# EasyEDA Pro project PicoUSBMotherboardV3.3.eprj, board PCB1
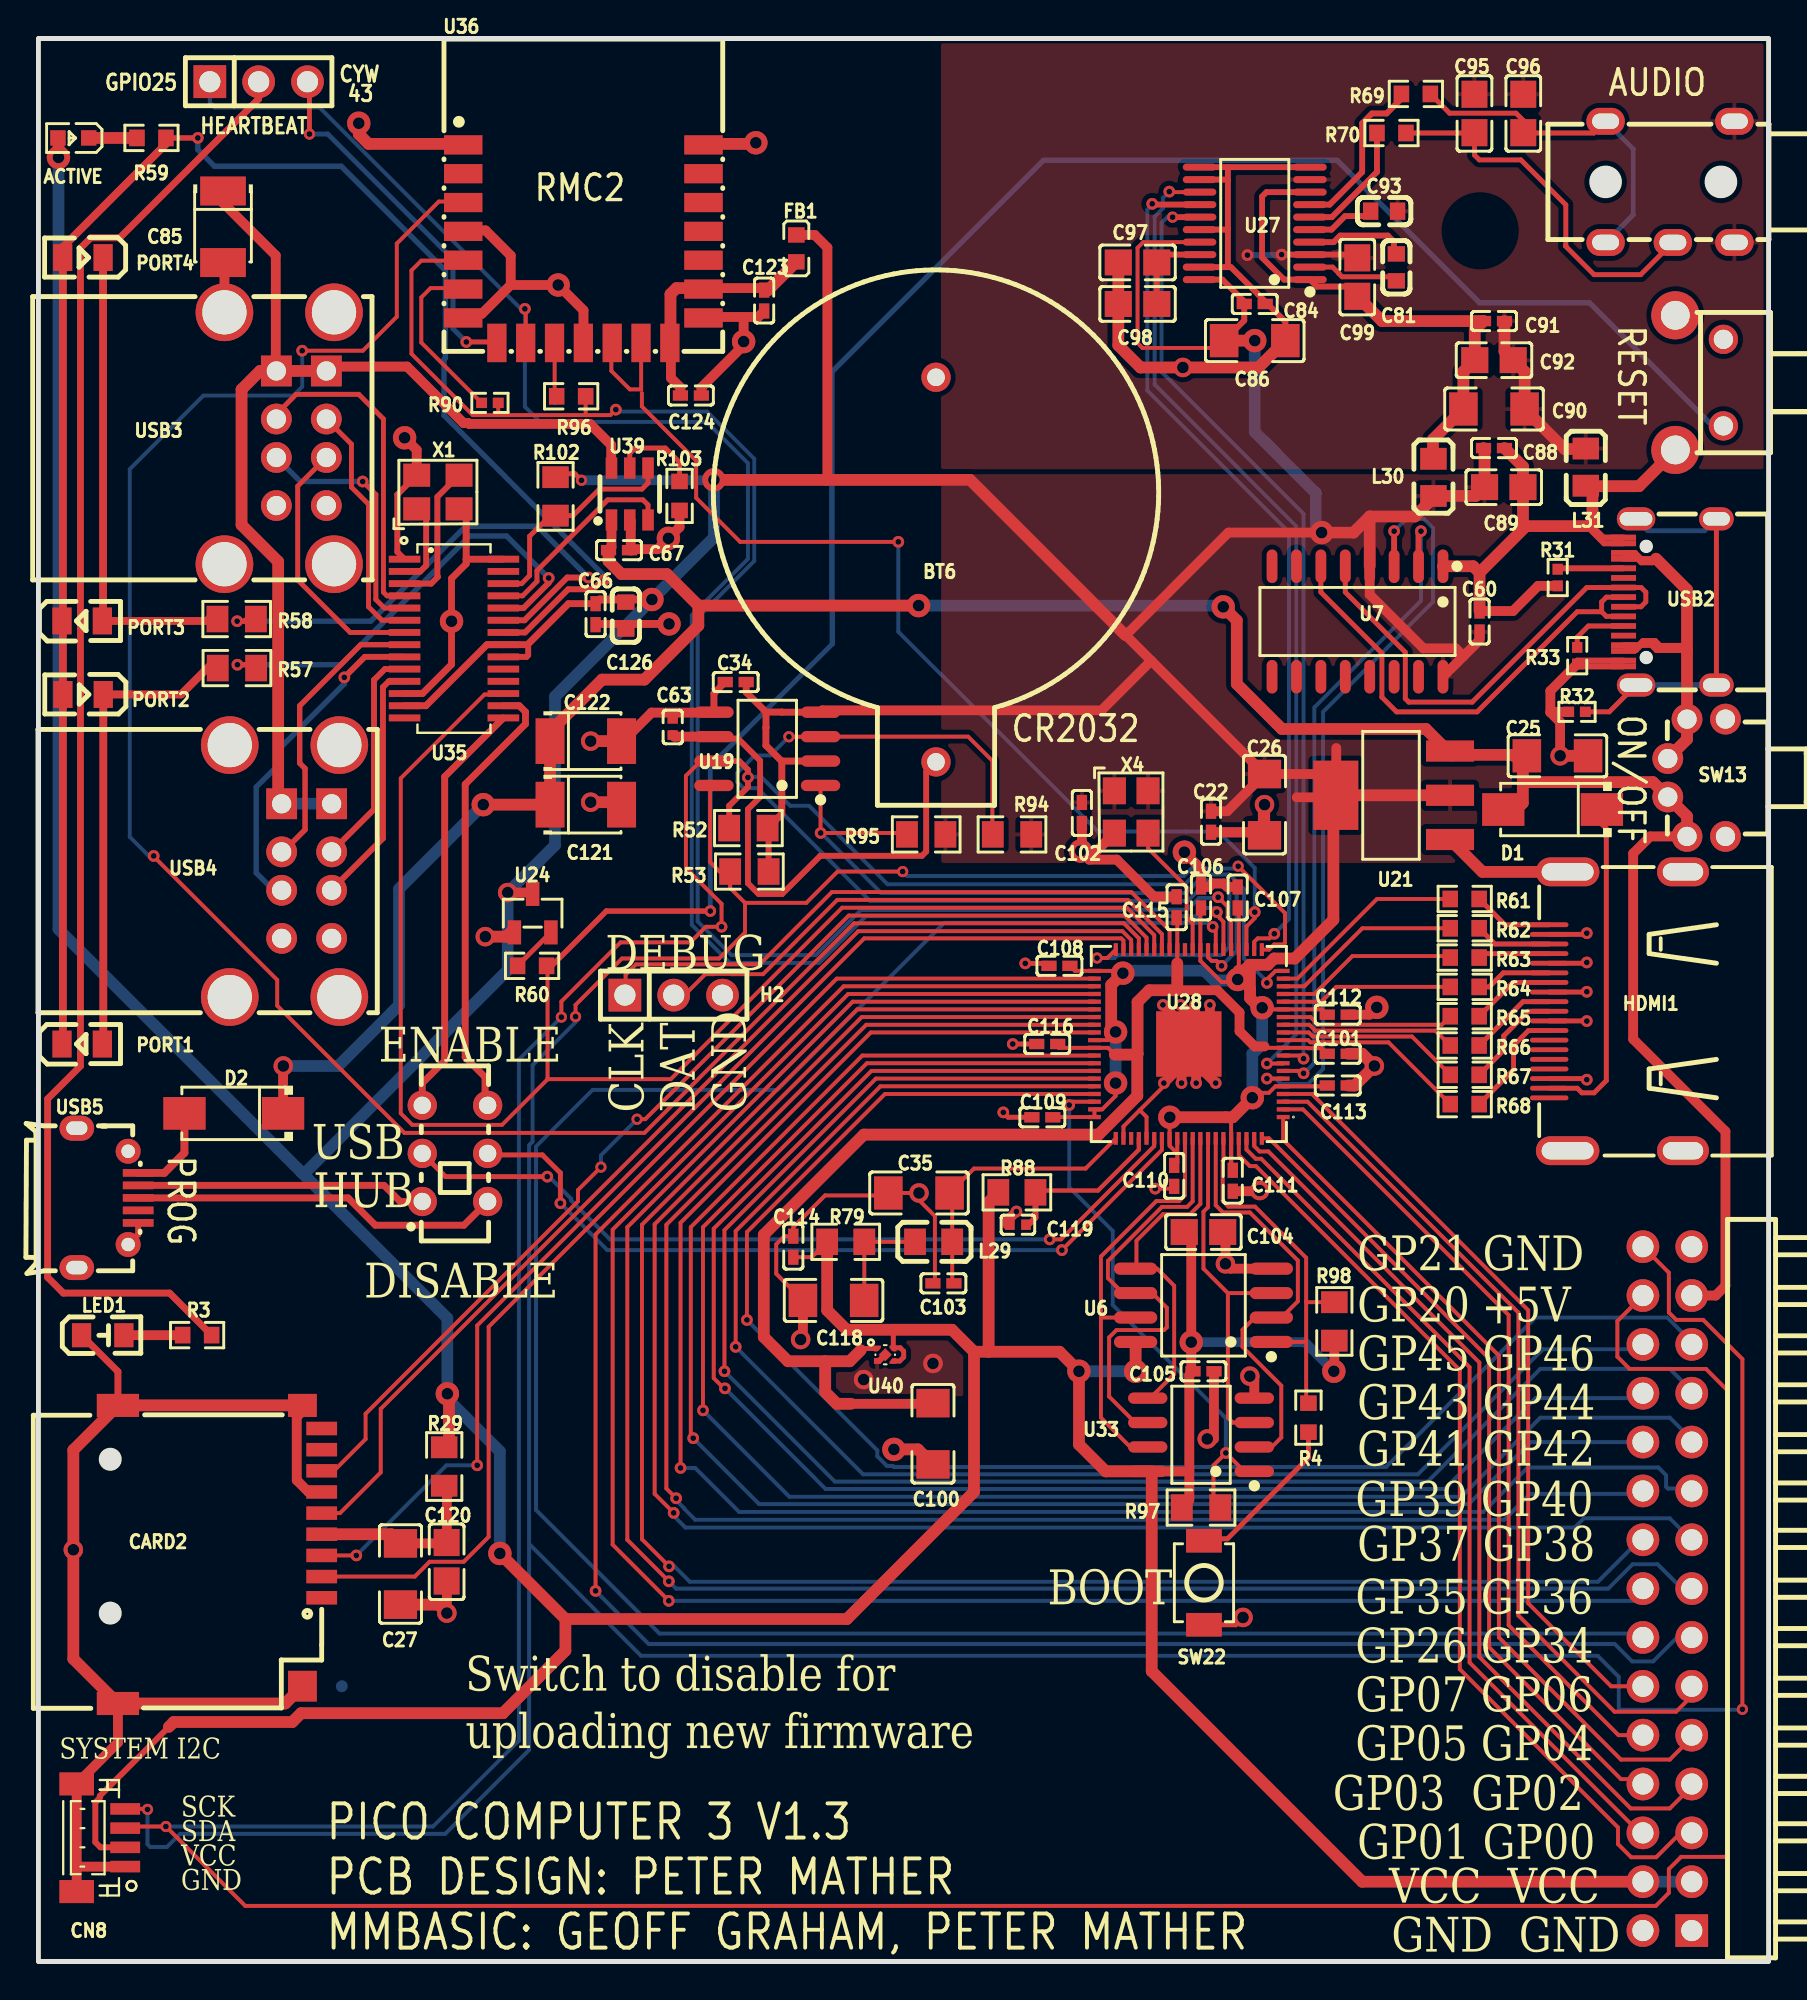
[diagram p1: board, top side]
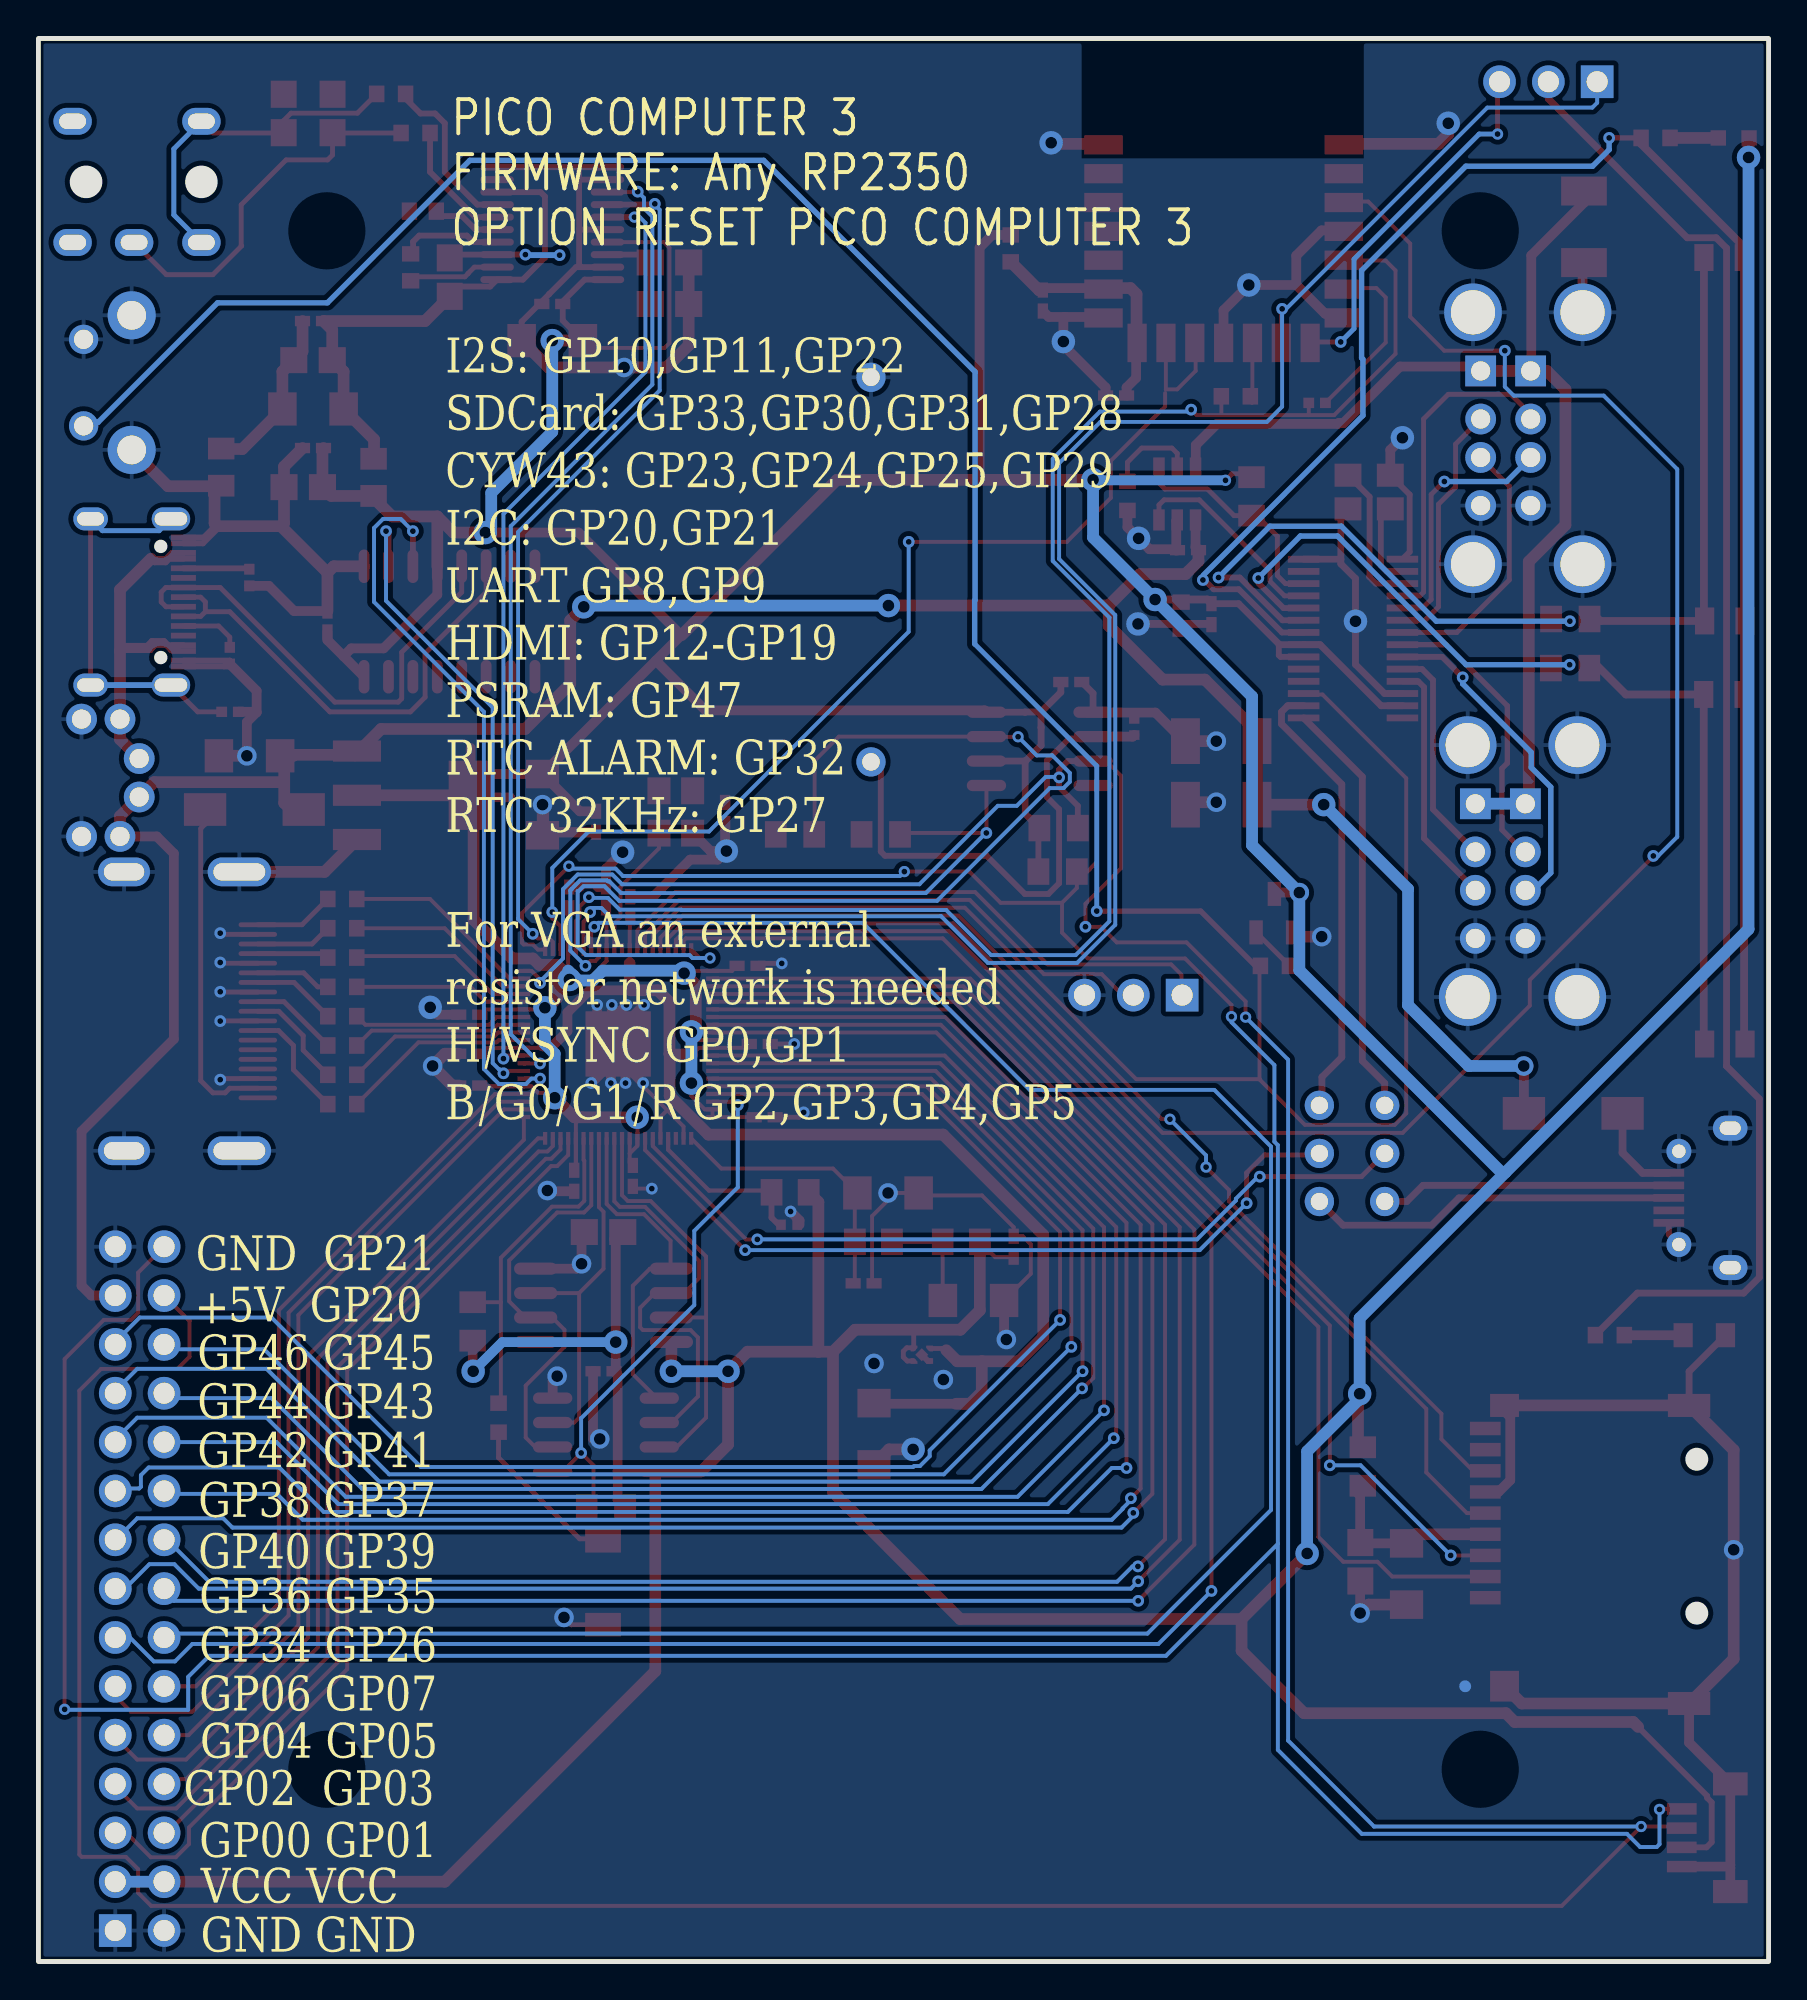
[diagram p2: board, bottom side, seen from below]

Outline 90 x 100 mm; copper layers: Top Layer, Bottom Layer. Coordinates in mm from the lower left corner of the outline.
Outline path: rectangle 0,100 90,0
Stack: Top Layer 0.035mm / Dielectric1 1.51mm FR4 er 4.5 / Bottom Layer 0.035mm

## Design rules (mm)
template: JLCPCB Capability(Two Layers Board)
spacing copperThickness1oz (default): track to track 0.102, other pairs 0.152 to 0.3
spacing copperThickness2oz: track to track 0.203, other pairs 0.152 to 0.3
track width copperThickness1oz (default): min 0.127, default 0.254, max 2.54
track width copperThickness2oz: min 0.203, default 0.254, max 2.54
differential pair differentialPair (default): width min 0.127, default 0.254, max 2.54; gap min 0.152, default 0.152
via viaSize (default): diameter min 0.5, default 0.61, max 10; hole min 0.3, default 0.305, max 6.3

## Placement (name value [footprint] x y rotation side)
ACTIVE  KT-0603R  [LED0603-RD]  1.81 94.83 180 top
BT6  BS-04-A1BJ005  [BAT-TH_BS-04-A1BJ004]  46.69 72.38 270 top
C22  100nF  [C0402_NEW]  61 59.27 90 top
C25  10uF  [C1206]  79.02 62.7 180 top
C26  10uF  [C1206]  63.78 60.16 90 top
C27  10uF  [C1206]  18.83 20.15 90 top
C34  100nF  [C0402_NEW]  36.27 66.53 180 top
C35  10uF  [C1206]  45.81 39.97 0 top
C60  100nF  [C0402_NEW]  74.97 69.68 270 top
C63  100nF  [C0402]  32.99 64.2 90 top
C66  100nF  [C0402_NEW]  28.98 70.06 90 top
C67  100nF  [C0402_NEW]  30.2 73.39 180 top
C81  2.2uF  [C0603]  70.64 88.1 90 top
C84  100nF  [C0402_NEW]  63.27 86.19 0 top
C85  100uF  [CASE-B_3528]  9.6 90.21 270 top
C86  10uF  [C1206]  63.27 84.29 180 top
C88  100nF  [C0402_NEW]  75.72 78.7 180 top
C89  1nF  [C0805]  76.23 76.67 180 top
C90  22uF  [C1206]  75.72 80.73 180 top
C91  100nF  [C0402_NEW]  75.72 85.3 180 top
C92  10nF  [C0805]  75.72 83.27 180 top
C93  2.2uF  [C0603]  70 91.02 0 top
C95  2.2nF  [C0805]  74.7 96.1 270 top
C96  2.2nF  [C0805]  77.24 96.1 270 top
C97  10uF  [C0805]  57.18 88.35 180 top
C98  100nF  [C0805]  57.18 86.19 180 top
C99  100nF  [C0805]  68.61 87.59 270 top
C100  10uF  [C1206]  46.53 27.44 90 top
C101  100nF  [C0402_NEW]  67.59 47.2 180 top
C102  100nF  [C0402_NEW]  54.28 59.73 90 top
C103  100nF  [C0402_NEW]  47.07 35.27 0 top
C104  100nF  [C0805]  60.6 37.93 180 top
C105  100nF  [C0402_NEW]  60.6 30.69 180 top
C106  100nF  [C0402_NEW]  60.48 55.33 270 top
C107  100nF  [C0402_NEW]  62.38 55.33 270 top
C108  100nF  [C0402_NEW]  53.11 51.78 0 top
C109  100nF  [C0402_NEW]  52.22 43.9 0 top
C110  100nF  [C0402_NEW]  59.08 40.85 90 top
C111  100nF  [C0402_NEW]  62.13 40.6 90 top
C112  100nF  [C0402_NEW]  67.59 49.24 180 top
C113  100nF  [C0402_NEW]  67.59 45.55 180 top
C114  100nF  [C0402_NEW]  39.27 37.17 270 top
C115  100nF  [C0402_NEW]  59.21 54.82 270 top
C116  100nF  [C0402_NEW]  52.48 47.71 0 top
C118  10uF  [C1206]  41.36 34.38 0 top
C119  2.2uF  [C0402]  50.95 38.31 180 top
C120  100nF  [C0805]  21.23 20.79 90 top
C121  100uF  [CASE-B_3528]  28.47 60.16 0 top
C122  100uF  [CASE-B_3528]  28.47 63.46 0 top
C123  100nF  [C0402_NEW]  37.75 86.37 270 top
C124  100nF  [C0402_NEW]  33.94 81.43 180 top
C126  10uF  [C0603]  30.56 69.99 90 top
CARD2  TF PUSH  [TF-SMD_TF-PUSH]  9.43 21.17 270 top
CN5  PJ-313 5JCJ  [AUDIO-TH_PJ-313_5JCJ]  84.87 92.54 180 top
CN8  BM04B-SRSS-TB(LF)(SN)  [CONN-SMD_BM04B-SRSS-TB]  3.25 6.44 90 top
D1  SS14  [SMA_L4.2-W2.6-LS5.3-RD]  78.77 59.9 180 top
D2  SS14  [SMA_L4.2-W2.6-LS5.3-RD]  10.16 44.11 180 top
FB1  BLM18EG471SN1D  [L0603]  39.42 89.08 90 top
H2  DEBUG  [HDR-TH_3P-P2.54-V-M]  33.05 50.25 0 top
H4  PZ254-2-15-W-8.5  [HDR-TH_30P-P2.54-H-M-R2-C15-S2.54-N]  84.73 19.39 90 top
H5  HEART  [HDR-TH_3P-P2.54-V-M]  11.46 97.75 0 top
HDMI1  HDMI-01  [USB-SMD_HDMI-01]  82.07 49.41 90 top
L29  10uH  [L0805]  46.57 37.43 180 top
L30  10uH  [L0805]  72.57 77.18 270 top
L31  10uH  [L0805]  80.49 77.71 90 top
LED1  NCD0805R1  [LED0805-RD]  3.34 32.57 0 top
PORT1  KT-0805G  [LED0805-R-RD]  2.28 47.71 0 top
PORT2  KT-0805G  [LED0805-R-RD]  2.32 65.89 180 top
PORT3  KT-0805G  [LED0805-R-RD]  2.28 69.71 0 top
PORT4  KT-0805G  [LED0805-R-RD]  2.31 88.61 180 top
R3  1kΩ  [R0603]  8.25 32.57 180 top
R4  1kΩ  [R0603]  66.07 28.28 270 top
R29  2.2Ω  [R0805]  21.11 25.74 90 top
R31  5.1kΩ  [R0402]  79.03 71.97 90 top
R32  5.1kΩ  [R0402]  80.05 67.9 90 top
R33  1MΩ  [R0402]  80.04 64.98 0 top
R52  10kΩ  [R0805]  36.93 58.94 0 top
R53  10kΩ  [R0805]  36.98 56.68 0 top
R57  220Ω  [R0805]  10.33 67.26 180 top
R58  220Ω  [R0805]  10.31 69.81 180 top
R59  470Ω  [R0603]  5.88 94.83 180 top
R60  220Ω  [R0603]  25.68 51.78 180 top
R61  220Ω  [R0603]  74.19 55.25 0 top
R62  220Ω  [R0603]  74.19 53.73 0 top
R63  220Ω  [R0603]  74.19 52.21 0 top
R64  220Ω  [R0603]  74.19 50.68 0 top
R65  220Ω  [R0603]  74.19 49.16 0 top
R66  220Ω  [R0603]  74.19 47.63 0 top
R67  220Ω  [R0603]  74.19 46.11 0 top
R68  220Ω  [R0603]  74.19 44.59 0 top
R69  470Ω  [R0603]  71.65 97.12 180 top
R70  470Ω  [R0603]  70.38 95.08 180 top
R79  10Ω  [R0805_NEW]  42 37.43 180 top
R88  10Ω  [R0805_NEW]  50.9 40 0 top
R90  470Ω  [R0402]  23.49 81.05 180 top
R94  10kΩ  [R0805]  50.64 58.61 0 top
R95  10kΩ  [R0805]  46.18 58.61 0 top
R96  10kΩ  [R0603]  27.71 81.39 180 top
R97  10kΩ  [R0805]  60.48 23.61 180 top
R98  10kΩ  [R0805]  67.41 33.29 270 top
R102  10kΩ  [R0805]  26.9 76.19 90 top
R103  20kΩ  [R0603]  33.35 76.21 90 top
SW13  XKB5858-Z-E  [SW-TH_XKB5858-Z-E]  86.26 61.56 270 top
SW15  TC-6615-7.5-260G  [SW-TH_4P-L7.5-W7.5-P4.50]  86.4 82.1 270 top
SW21  MSS22D18G2  [SW-TH_MSS22D18GX]  21.67 42.02 90 top
SW22  TS-1088-AR02016  [SW-SMD_L3.9-W3.0-P4.45]  60.63 19.7 270 top
U6  W25Q128JVSIQ  [SOIC-8_L5.3-W5.3-P1.27-LS8.0-BL]  60.6 34.12 90 top
U7  CH340C  [SOP-16_L10.0-W3.9-P1.27-LS6.0-BL]  68.62 69.68 180 top
U19  DS3231MZ+TRL  [SOIC-8_L4.9-W3.9-P1.27-LS6.0-BL]  37.91 63.06 90 top
U21  AMS1117-3.3  [SOT-223-3_L6.5-W3.4-P2.30-LS7.0-BR]  70.46 60.65 0 top
U24  MAX809R  [SOT-23-3_L2.9-W1.3-P1.90-LS2.4-BR]  25.71 54.52 270 top
U27  PCM5102APWR  [TSSOP-20_L6.5-W4.4-P0.65-LS6.4-BL]  63.27 90.38 90 top
U28  RP2350B  [QFN-80_L10.0-W10.0-P0.40-TL-EP3.4]  59.84 47.71 180 top
U33  APS6404L-3SQR-SN  [SOIC-8_L4.9-W3.9-P1.27-LS6.0-BL]  60.48 27.39 90 top
U35  CH334U  [QSOP-28_L9.9-W3.9-P0.64-LS6.0-BL]  21.62 68.79 270 top
U36  RMC20452T  [WIRELM-SMD_RMC20452T]  28.35 89.32 0 top
U39  TPS2552DBVR  [SOT-23-6_L2.9-W1.6-P0.95-LS2.8-BR]  30.76 76.31 270 top
U40  LW31135N11E  [UDFN-4_L1.0-W1.0-P0.65-TL]  44.05 31.55 0 top
USB2  KH-TYPE-C-16P  [USB-C-SMD_KH-TYPE-C-16P]  84.87 70.7 90 top
USB3  AF SS-JB17.6  [USB-A-TH_AF-SS-JB17.6]  12.53 79.21 270 top
USB4  AF SS-JB17.6  [USB-A-TH_AF-SS-JB17.6]  12.8 56.7 270 top
USB5  MicroXNJ  [MICRO-USB-SMD_MICROXNJ]  3.59 39.71 270 top
X1  12MHz  [OSC-SMD_4P-L3.2-W2.5-BL]  20.78 76.41 0 top
X4  12MHz  [OSC-SMD_4P-L3.2-W2.5-BL]  56.85 59.78 270 top

## Footprints (pads in the part's own frame, mm; a bottom-side part is the same pattern mirrored in y, then rotated)
AUDIO-TH_PJ-313_5JCJ
  oval 2x1.4 hole 1.4x0.8: 1(-3.35,3.15) 1(-3.35,-3.15) 2(3.35,3.15) 2(3.35,-3.15) 3(-0.15,3.15)
BAT-TH_BS-04-A1BJ004
  round 1.524 hole 0.914: 1(10,0) 2(-10,0)
C0402
  rect 0.5x0.54 smd: 1(-0.42,0) 2(0.42,0)
C0402_NEW
  rect 0.79x0.54 smd: 1(-0.545,0) 2(0.545,0)
C0603
  rect 0.8x0.9 smd: 1(-0.7,0) 2(0.7,0)
C0805
  rect 1.41x1.35 smd: 1(-1,0) 2(1,0)
C1206
  rect 1.485x1.728 smd: 1(-1.593,0) 2(1.593,0)
CASE-B_3528
  rect 1.506x2.376 smd: 1(-1.861,0) 2(1.861,0)
CONN-SMD_BM04B-SRSS-TB
  rect 1.2x1.8 smd: 0(-2.8,1.262) 0(2.8,1.262)
  rect 0.6x1.55 smd: 1(-1.5,-1.262) 2(-0.5,-1.262) 3(0.5,-1.262) 4(1.5,-1.262)
HDR-TH_3P-P2.54-V-M
  rect 1.7x1.7 hole 1.1: 1(-2.54,0)
  round 1.7 hole 1.1: 2(0,0) 3(2.54,0)
HDR-TH_30P-P2.54-H-M-R2-C15-S2.54-N
  rect 1.7x1.7 hole 1.1: 1(-17.78,-1.27)
  round 1.7 hole 1.1: 2(-17.78,1.27) 3(-15.24,-1.27) 4(-15.24,1.27) 5(-12.7,-1.27) 6(-12.7,1.27) 7(-10.16,-1.27) 8(-10.16,1.27) 9(-7.62,-1.27) 10(-7.62,1.27) 11(-5.08,-1.27) 12(-5.08,1.27) 13(-2.54,-1.27) 14(-2.54,1.27) 15(0,-1.27) 16(0,1.27) 17(2.54,-1.27) 18(2.54,1.27) 19(5.08,-1.27) 20(5.08,1.27) 21(7.62,-1.27) 22(7.62,1.27) 23(10.16,-1.27) 24(10.16,1.27) 25(12.7,-1.27) 26(12.7,1.27) 27(15.24,-1.27) 28(15.24,1.27) 29(17.78,-1.27) 30(17.78,1.27)
L0603
  rect 0.8x0.864 smd: 1(-0.7,0) 2(0.7,0)
L0805
  rect 1.133x1.377 smd: 1(-0.966,0) 2(0.966,0)
LED0603-RD
  rect 0.8x0.8 smd: 1(-0.799,0) 2(0.799,0)
LED0805-R-RD
  rect 1x1.399 smd: 1(1.05,0) 2(-1.05,0)
LED0805-RD
  rect 1x1.25 smd: 1(-1.1,0) 2(1.1,0)
MICRO-USB-SMD_MICROXNJ
  rect 0.4x1.6 smd: 1(-1.3,1.597) 2(-0.65,1.597) 3(0,1.597) 4(0.65,1.597) 5(1.3,1.597)
  round 1.3 hole 0.7: 6(2.425,1.074) 9(-2.425,1.073)
  oval 1.3x1.8 hole 0.7x1.1: 7(3.625,-1.597) 8(-3.625,-1.597)
OSC-SMD_4P-L3.2-W2.5-BL
  rect 1.4x1.2 smd: 1(-1.1,-0.875) 2(1.1,-0.875) 3(1.1,0.875) 4(-1.1,0.875)
QFN-80_L10.0-W10.0-P0.40-TL-EP3.4
  rect 0.665x0.22 smd: 1(-4.907,3.8) 2(-4.907,3.4) 3(-4.907,3) 4(-4.907,2.6) 5(-4.907,2.2) 6(-4.907,1.8) 7(-4.907,1.4) 8(-4.907,1) 9(-4.907,0.6) 10(-4.907,0.2) 11(-4.907,-0.2) 12(-4.907,-0.6) 13(-4.907,-1) 14(-4.907,-1.4) 15(-4.907,-1.8) 16(-4.907,-2.2) 17(-4.907,-2.6) 18(-4.907,-3) 19(-4.907,-3.4) 20(-4.907,-3.8) 41(4.907,-3.8) 42(4.907,-3.4) 43(4.907,-3) 44(4.907,-2.6) 45(4.907,-2.2) 46(4.907,-1.8) 47(4.907,-1.4) 48(4.907,-1) 49(4.907,-0.6) 50(4.907,-0.2) 51(4.907,0.2) 52(4.907,0.6) 53(4.907,1) 54(4.907,1.4) 55(4.907,1.8) 56(4.907,2.2) 57(4.907,2.6) 58(4.907,3) 59(4.907,3.4) 60(4.907,3.8)
  rect 0.22x0.665 smd: 21(-3.8,-4.907) 22(-3.4,-4.907) 23(-3,-4.907) 24(-2.6,-4.907) 25(-2.2,-4.907) 26(-1.8,-4.907) 27(-1.4,-4.907) 28(-1,-4.907) 29(-0.6,-4.907) 30(-0.2,-4.907) 31(0.2,-4.907) 32(0.6,-4.907) 33(1,-4.907) 34(1.4,-4.907) 35(1.8,-4.907) 36(2.2,-4.907) 37(2.6,-4.907) 38(3,-4.907) 39(3.4,-4.907) 40(3.8,-4.907) 61(3.8,4.907) 62(3.4,4.907) 63(3,4.907) 64(2.6,4.907) 65(2.2,4.907) 66(1.8,4.907) 67(1.4,4.907) 68(1,4.907) 69(0.6,4.907) 70(0.2,4.907) 71(-0.2,4.907) 72(-0.6,4.907) 73(-1,4.907) 74(-1.4,4.907) 75(-1.8,4.907) 76(-2.2,4.907) 77(-2.6,4.907) 78(-3,4.907) 79(-3.4,4.907) 80(-3.8,4.907)
  rect 3.4x3.4 smd: 81(0,0)
QSOP-28_L9.9-W3.9-P0.64-LS6.0-BL
  rect 0.355x1.64 smd: 1(-4.128,-2.57) 2(-3.493,-2.57) 3(-2.857,-2.57) 4(-2.223,-2.57) 5(-1.587,-2.57) 6(-0.953,-2.57) 7(-0.318,-2.57) 8(0.318,-2.57) 9(0.953,-2.57) 10(1.587,-2.57) 11(2.223,-2.57) 12(2.857,-2.57) 13(3.493,-2.57) 14(4.128,-2.57) 15(4.128,2.57) 16(3.493,2.57) 17(2.857,2.57) 18(2.223,2.57) 19(1.587,2.57) 20(0.953,2.57) 21(0.318,2.57) 22(-0.318,2.57) 23(-0.953,2.57) 24(-1.587,2.57) 25(-2.223,2.57) 26(-2.857,2.57) 27(-3.493,2.57) 28(-4.128,2.57)
R0402
  rect 0.566x0.54 smd: 1(-0.433,0) 2(0.433,0)
R0603
  rect 0.806x0.864 smd: 1(-0.753,0) 2(0.753,0)
R0805
  rect 1.133x1.377 smd: 1(-1,0) 2(1,0)
R0805_NEW
  rect 1.133x1.377 smd: 1(-0.966,0) 2(0.966,0)
SMA_L4.2-W2.6-LS5.3-RD
  rect 2.2x1.7 smd: 1(-2.566,0) 2(2.566,0)
SOIC-8_L4.9-W3.9-P1.27-LS6.0-BL
  oval 0.588x2.045 smd: 1(-1.905,-2.772) 2(-0.635,-2.772) 3(0.635,-2.772) 4(1.905,-2.772) 5(1.905,2.772) 6(0.635,2.772) 7(-0.635,2.772) 8(-1.905,2.772)
SOIC-8_L5.3-W5.3-P1.27-LS8.0-BL
  oval 0.63x2.25 smd: 1(-1.905,-3.53) 2(-0.635,-3.53) 3(0.635,-3.53) 4(1.905,-3.53) 5(1.905,3.53) 6(0.635,3.53) 7(-0.635,3.53) 8(-1.905,3.53)
SOP-16_L10.0-W3.9-P1.27-LS6.0-BL
  oval 0.56x1.745 smd: 1(-4.445,-2.873) 2(-3.175,-2.873) 3(-1.905,-2.873) 4(-0.635,-2.873) 5(0.635,-2.873) 6(1.905,-2.873) 7(3.175,-2.873) 8(4.445,-2.873) 9(4.445,2.873) 10(3.175,2.873) 11(1.905,2.873) 12(0.635,2.873) 13(-0.635,2.873) 14(-1.905,2.873) 15(-3.175,2.873) 16(-4.445,2.873)
SOT-23-3_L2.9-W1.3-P1.90-LS2.4-BR
  rect 1.25x0.7 smd: 1(1,-0.95) 2(1,0.95) 3(-1,0)
SOT-23-6_L2.9-W1.6-P0.95-LS2.8-BR
  rect 1.1x0.6 smd: 1(1.35,-0.95) 2(1.35,0) 3(1.35,0.95) 4(-1.35,0.95) 5(-1.35,0) 6(-1.35,-0.95)
SOT-223-3_L6.5-W3.4-P2.30-LS7.0-BR
  rect 2.5x1.1 smd: 1(2.97,-2.3) 2(2.97,0) 3(2.97,2.3)
  rect 2.34x3.6 smd: 4(-2.97,0)
SW-SMD_L3.9-W3.0-P4.45
  rect 1.23x1.86 smd: 1(-2.185,0) 2(2.185,0)
SW-TH_4P-L7.5-W7.5-P4.50
  round 1.524 hole 1: 1(-2.25,1.25) 2(2.25,1.25)
  round 2.5 hole 1.5: 3(-3.5,-1.25) 4(3.5,-1.25)
SW-TH_MSS22D18GX
  round 1.524 hole 0.9: 1(-2.5,1.7) 2(0,1.7) 3(2.5,1.7) 4(-2.5,-1.7) 5(0,-1.7) 6(2.5,-1.7)
SW-TH_XKB5858-Z-E
  round 1.6 hole 1: 1(-3.05,1.5) 2(-3.05,-0.5) 3(3.05,1.5) 4(3.05,-0.5) 5(-1,-1.5) 6(1,-1.5)
TF-SMD_TF-PUSH
  rect 0.7x1.6 smd: 1(2.25,5.3) 2(1.15,5.3) 3(0.05,5.3) 4(-1.05,5.3) 5(-2.15,5.3) 6(-3.25,5.3) 7(-4.35,5.3) 8(-5.45,5.3) CD(-6.55,5.3)
  rect 1.2x1.5 smd: 10(-7.75,4.3)
  rect 1.2x2.2 smd: 11(-7.75,-5.3) 12(7.75,-5.3)
  rect 1.6x1.5 smd: 13(6.85,4.3)
TSSOP-20_L6.5-W4.4-P0.65-LS6.4-BL
  oval 0.364x1.742 smd: 1(-2.925,-2.871) 2(-2.275,-2.871) 3(-1.625,-2.871) 4(-0.975,-2.871) 5(-0.325,-2.871) 6(0.325,-2.871) 7(0.975,-2.871) 8(1.625,-2.871) 9(2.275,-2.871) 10(2.925,-2.871) 11(2.925,2.871) 12(2.275,2.871) 13(1.625,2.871) 14(0.975,2.871) 15(0.325,2.871) 16(-0.325,2.871) 17(-0.975,2.871) 18(-1.625,2.871) 19(-2.275,2.871) 20(-2.925,2.871)
UDFN-4_L1.0-W1.0-P0.65-TL
  custom 0.36x0.3 smd: 1(-0.421,0.326) 2(-0.421,-0.325) 3(0.421,-0.326) 4(0.421,0.325)
  rect 0.48x0.48 smd rot 135: 5(0.002,0.001)
USB-A-TH_AF-SS-JB17.6
  rect 1.6x1.6 hole 1: 1(-3.5,2.45) 5(-3.5,-0.15)
  round 1.6 hole 1: 2(-1,2.45) 3(1,2.45) 4(3.5,2.45) 6(-1,-0.15) 7(1,-0.15) 8(3.5,-0.15)
  round 3 hole 2.3: 9(-6.55,2.85) 10(6.55,2.85) 11(-6.55,-2.85) 12(6.55,-2.85)
USB-C-SMD_KH-TYPE-C-16P
  oval 1.2x2 hole 0.7x1.7: 1(-4.32,1.765) 2(4.32,1.765)
  oval 1.2x1.8 hole 0.7x1.4: 3(-4.32,-2.415) 4(4.32,-2.415)
  rect 0.3x1.3 smd: A1(-3.35,2.415) A4(-2.55,2.415) A5(-1.25,2.415) A6(-0.25,2.415) A7(0.25,2.415) A8(1.25,2.415) A9(2.55,2.415) A12(3.35,2.415) B1(3.05,2.415) B4(2.25,2.415) B5(1.75,2.415) B6(0.75,2.415) B7(-0.75,2.415) B8(-1.75,2.415) B9(-2.25,2.415) B12(-3.05,2.415)
USB-SMD_HDMI-01
  oval 0.25x2 smd: 1(4.501,3.479) 2(4,3.479) 3(3.5,3.479) 4(2.999,3.479) 5(2.499,3.479) 6(1.999,3.479) 7(1.501,3.479) 8(1.001,3.479) 9(0.5,3.479) 10(0,3.479) 11(-0.5,3.479) 12(-1.001,3.479) 13(-1.498,3.479) 14(-1.999,3.479) 15(-2.499,3.479) 16(-2.999,3.479) 17(-3.5,3.479) 18(-4,3.479) 19(-4.501,3.479)
  oval 1.5x2.7 hole 0.9x2.1: 20(7.25,-3.479) 21(-7.25,-3.479)
  oval 1.5x3.3 hole 0.9x2.7: 22(7.25,2.52) 23(-7.25,2.52)
WIRELM-SMD_RMC20452T
  rect 2x1 smd: 1(-6.25,5.15) 2(-6.25,3.65) 3(-6.25,2.15) 4(-6.25,0.65) 5(-6.25,-0.85) 6(-6.25,-2.35) 7(-6.25,-3.85) 15(6.25,-3.85) 16(6.25,-2.35) 17(6.25,-0.85) 18(6.25,0.65) 19(6.25,2.15) 20(6.25,3.65) 21(6.25,5.15)
  rect 1x2 smd: 8(-4.5,-5.15) 9(-3,-5.15) 10(-1.5,-5.15) 11(0,-5.15) 12(1.5,-5.15) 13(3,-5.15) 14(4.5,-5.15)

## Nets
As in the schematic.

Pads without a net: CARD2 1 8 CD; HDMI1 13 14 15 16 19; U7 7 8 9 10 11 12 13 14 15; U28 31 63; U35 14 18 19 27; U36 2 17 18 19 20; USB2 A8 B8; USB5 4

## Via types
v1: diameter 1.219, hole 0.61, Top Layer to Bottom Layer, 33 vias
v2: diameter 0.584, hole 0.305, Top Layer to Bottom Layer, 14 vias
v3: diameter 1.016, hole 0.61, Top Layer to Bottom Layer, 20 vias
v4: diameter 0.61, hole 0.305, Top Layer to Bottom Layer, 74 vias

## Routing (per net, layer and track width the routed paths; a pad name or vN(x,y) marks a point on that pad's centre or on a via; arc(x,y) is an arc through that point)
5VIN: length 21.6
  Top Layer w0.305: USB2.A9 83.05,73.25 83.37,72.93 84.13,72.93 ; 85.76,68.16 85.72,68.2 84.17,68.2 83.91,68.46 83.37,68.46 83.1,68.2 82.71,68.2 ; USB2.B4 83.19,72.95 83.38,72.76 83.96,72.76 84.13,72.93 ; USB2.B9 83.25,68.45 83.46,68.67 84.1,68.67 84.35,68.41 85.5,68.41 ; 84.15,72.95 84.13,72.93
  Top Layer w0.61: SW13.5 85.76,63.56 SW13.2 85.76,71.34 84.15,72.95
+5V: length 140.2
  Top Layer w0.508: SW13.4 83.84,58.51 82.96,57.62 82.96,47.97 87.76,43.17 87.76,35.14 87.25,34.63 H4.27 ; v3(12.74,46.57) 12.73,46.56 D2.1 ; U39.1 29.81,73.55 C67.2
  Top Layer w0.61: D1.2 76.88,59.9 77.22,60.24 77.22,61.33 ; 73.43,62.84 72.17,64.09 64.68,64.09 62.34,66.44 62.34,69.74 v1(61.63,70.44) ; 73.43,62.84 U21.3 ; 73.43,62.84 73.55,62.72 73.55,62.75 76.69,62.75 76.74,62.7 C25.2 77.22,62.49 77.22,61.33 ; v1(45.78,70.51) 34.33,70.51 ; 34.33,70.51 32.69,72.15 30.33,72.15 29.66,72.82 C67.2 ; 34.33,70.51 34.33,69.47 31.52,66.66 29.32,66.66 26.61,63.95 C121.1 v1(23.14,60.16) ; 77.22,61.33 83.98,61.33 SW13.6 85.76,59.56 SW13.4
  Bottom Layer w0.61: v1(23.14,60.16) 18.76,55.77 18.76,49.73 15.59,46.57 v3(12.74,46.57) ; v1(45.78,70.51) 61.57,70.51 v1(61.63,70.44)
AGND: length 14.3
  Top Layer w0.305: 68.61,89.1 68.27,88.76 v4(64.67,88.76)
  Top Layer w0.61: 79.91,78.65 79.39,78.65 C90.1 77.31,82.68 C92.1 76.26,83.73 C91.1
  Bottom Layer w0.305: v4(64.67,88.76) 64.64,88.73 v4(62.89,88.73)
AVDD: length 26.7
  Top Layer w0.305: 68.61,87.1 66.5,87.1 66.14,87.46 64.8,87.46 63.65,88.61 63.65,91.78 63.88,92.01 66.14,92.01
  Top Layer w0.61: 72.54,78.14 72.54,79.15 C90.2 74.12,82.68 C92.2 74.72,84.85 C91.2 69.89,85.3 C99.2
DVDD: length 67
  Top Layer w0.203: 63.78,47.59 63.78,47.51 U28.10 66.02,47.51 66.04,47.49 66.76,47.49 C101.2 ; 55.99,47.16 55.64,47.51 U28.51 53.08,47.51 53.02,47.57 C116.2 ; C115.2 59.24,54.24 U28.32 59.24,51.9
  Top Layer w0.254: U40.1 42.87,31.88
  Top Layer w0.508: 63.78,47.59 63.27,47.59 62.48,48.38 62.48,49.35 61.32,50.51 59.18,50.51 ; 42.27,29 46.5,29 C100.2
  Top Layer w0.61: 55.99,47.16 57.14,47.16 57.16,47.19 ; 57.16,47.19 57.16,45.01 55.15,43 42.94,43 37.73,37.79 37.73,32.47 38.99,31.22 40.93,31.22 ; 57.16,47.19 57.18,47.2 57.18,49.9 57.78,50.51 59.18,50.51 59.24,50.56 59.24,51.9 ; 40.93,31.22 42.2,31.22 42.77,31.79 ; 40.93,31.22 40.93,29.61 41.54,29 42.27,29
GND: length 321.6
  Top Layer w0.203: 57.64,42.8 57.64,43.92 57.29,44.27 ; 57.29,44.27 58.54,45.53 v4(58.54,45.68) ; 57.29,44.27 56.44,43.42 U28.62 ; v3(63.78,60.16) 63.75,60.13 ; C110.1 58.96,40.19 v4(58.09,40.19) ; C118.1 38.38,35.77 38.38,37.3 38.8,37.72 C114.1 39.27,38.19 40.92,39.84 44.09,39.84 C35.1 45.43,39.97 46.63,38.76 46.63,35.37 C103.1
  Top Layer w0.254: HDMI1.2 80.48,53.41 v4(80.54,53.48) ; 52.57,51.9 v4(51.33,51.9) ; HDMI1.17 80.49,45.91 v4(80.54,45.86) ; v4(80.54,51.95) 80.5,51.91 HDMI1.5 ; C109.1 50.44,43.9 v4(50.19,44.16) ; v4(80.54,48.9) 80.54,48.91 HDMI1.11 ; SW22.2 62.28,17.51 v3(62.66,17.89) ; C116.1 51.93,47.62 51.84,47.71 v4(50.68,47.71) ; HDMI1.8 80.53,50.41 v4(80.54,50.43)
  Top Layer w0.305: U27.16 61.84,90.06 61.87,90.09 ; 61.87,90.09 61.87,88.22 61.77,88.11 ; 61.87,90.09 61.87,92.66 ; U35.1 18.67,73.3 18.67,76.28 X1.4 ; USB2.B1 81.44,73.75 80.68,74.51 80.68,74.64 ; USB2.A12 81.41,74.05 80.93,74.52 80.93,74.89 ; USB2.B12 80.05,67.65 80.35,67.35 USB2.A1 ; USB5.6 5.19,37.81 USB5.5 ; 61.88,93.31 U27.11 ; 61.88,93.31 66.14,93.31 ; 61.88,93.31 61.87,93.31 61.87,92.66 ; 61.77,88.11 62.03,88.11 63.43,86.72 63.43,86.71 64.86,85.27 C86.1 ; 61.77,88.11 U27.19 ; 61.87,92.66 U27.12 ; U40.2 43.72,31.23 U40.5
  Top Layer w0.355: 4.13,28.92 4.13,30.68 LED1.1 ; U35.28 22.26,72.92 22.25,72.91 ; 22.25,72.91 22.25,75.17 X1.2 ; 22.25,72.91 22.25,72.68 21.49,71.92 v1(21.49,69.7) 21.49,67.45 19.98,65.94 U35.12 ; U19.5 35.14,65.95 35.73,66.53
  Top Layer w0.406: C66.1 29.02,69.55 v1(32.8,69.55)
  Top Layer w0.508: 30.81,73.44 32.21,73.44 v1(32.77,74.01) 33.35,74.59 R103.1 ; 30.81,73.44 30.8,73.44 C67.1 ; 30.81,73.44 30.81,73.37 ; 30.81,73.44 30.81,74.91 U39.2 ; C60.1 76.71,70.23 78.01,71.54 79.03,71.54 ; C111.1 63.49,40.06 v3(63.53,40.09) ; v4(60.22,45.68) 60.22,46.7 ; 60.22,46.7 v4(61.24,45.68) ; 60.22,46.7 59.84,47.08 U28.81 ; 24.56,87.18 v1(27.04,87.18) 28.35,85.86 28.35,83.96 ; 24.56,87.18 23.07,85.69 21.89,85.69 21.72,85.52 ; 24.56,87.18 24.57,87.18 24.57,88.71 23.26,90.02 21.72,90.02 ; v3(39.65,32.35) 39.77,32.46 C118.1 ; 78.65,64.96 79.16,64.45 v3(79.16,62.7) ; 78.65,64.96 78.65,66.07 80.05,67.47 ; 78.65,64.96 78.67,64.98 R33.1 ; 50.41,38.31 50.41,38.54 v4(50.87,39) ; v1(54.21,57.75) 55.04,57.75 X4.2 ; v1(54.21,57.75) 54.28,57.81 C102.1 ; v1(54.21,57.75) 54.66,57.3 56.1,57.3 58.03,55.37 C115.1 ; C123.2 37.44,85.52 36.62,85.52 ; C112.1 69.24,49.24 v1(69.62,49.62) ; v4(60.17,49.74) 60.17,48.04 60.94,48.81 v4(60.94,49.74) ; C122.2 30.41,63.46 31.89,64.95 35.44,64.95 ; C120.1 21.25,19.78 v3(21.25,18.12) ; USB3.11 9.68,88.52 9.6,88.6 9.55,88.6 ; U6.4 62,36.03 v3(61.75,36.28) 61.75,37.79 C104.1 ; C105.1 61.15,27.18 v3(60.8,27.18) 60.67,27.31 ; 2.06,4.94 1.99,4.87 CN8.0 ; 2.06,4.94 1.99,5.01 1.99,9.24 4.13,11.38 4.13,13.42 ; 2.06,4.94 CN8.1 ; U33.4 63.25,30.21 v3(63.02,30.44) ; CARD2.10 13.73,28.61 13.44,28.32 13.44,25.03 14.05,24.42 CARD2.6 ; 36.62,85.52 36.68,85.46 v1(36.68,84.24) 36.68,84.05 34.49,81.85 C124.1 ; 36.62,85.52 34.88,85.52 ; v4(58.54,45.68) 59.46,46.6 v4(59.46,45.68) ; v1(19.05,79.24) 19.68,78.61 X1.4 ; v4(59.41,49.74) 59.84,49.31 59.84,48.4 v4(58.5,49.74) ; v1(59.61,57.69) 60.48,56.82 C106.1 60.89,55.88 61.07,56.06 61.66,56.06 61.84,55.88 C107.1
  Top Layer w0.533: C22.1 63.62,58.72 63.75,58.59
  Top Layer w0.61: 74.97,72.22 C60.1 ; 74.97,72.22 77.38,74.64 ; 74.97,72.22 74.63,72.55 U7.1 ; 77.38,74.64 77.23,74.8 C89.1 77.23,77.74 C88.1 ; 77.38,74.64 80.68,74.64 80.84,74.8 80.84,76.72 ; C25.1 79.16,62.7 ; v3(23.24,53.29) 24.34,53.29 24.74,53.7 ; CARD2.10 4.13,28.92 1.81,26.6 v3(1.81,21.41) 1.81,15.74 4.13,13.42 12.83,13.42 CARD2.13 ; 63.75,58.59 C26.1 ; 34.86,94.52 37.26,94.52 v1(37.32,94.58) ; C97.2 C98.2 56.18,84.04 57.33,82.89 v3(59.53,82.89) 63.47,82.89 C86.1 ; 80.84,76.72 83.26,76.72 SW15.4 ; 80.84,76.72 80.42,76.72 ; v3(28.73,60.29) 30.21,60.29 C121.2 ; C101.1 68.86,47.2 v3(69.49,46.57) 68.48,45.55 C113.1 ; v3(21.25,18.12) 20.81,18.56 C27.1 ; v3(28.73,63.46) C122.2 ; C100.1 45.75,26.63 v1(44.5,26.63) ; HDMI1.22 75.11,56.66 73.43,58.35 ; 21.87,94.52 17.17,94.52 16.66,95.03 v1(16.66,95.59)
  Top Layer w0.635: 63.75,60.13 63.75,58.59
  Bottom Layer w0.61: 15.78,14.32 15.78,14.31
  vias: v3(42.93,30.26) v3(45.81,39.97) v3(46.53,31.1)
VBAT: length 27
  Top Layer w0.305: U19.6 35.24,63.59 36.39,63.59 37.54,62.44 37.54,60.55 36.91,59.92 36.91,56.07 37.47,55.51 38.68,55.51 40.67,57.5 45.96,57.5 46.18,57.72 46.18,61.87 BT6.1
  Top Layer w0.508: U19.6 33.08,63.69 32.99,63.78
VCC: length 578.4
  Top Layer w0.203: 63.74,49.51 U28.15 66.77,49.51 C112.2 ; v1(56.41,51.4) 56.3,51.51 U28.41 53.92,51.51 C108.2 ; C110.2 59.24,41.56 59.24,42.02 ; C109.2 52.78,43.91 U28.60 U28.59 55.34,44.31 56.03,45.01 v1(56.03,45.68) ; C114.2 40.23,36.63 R79.2 ; v1(56.03,48.34) 55.61,47.91 U28.50 ; v1(58.85,43.9) 58.84,43.89 U28.68 58.84,42.42 59.24,42.02 ; U28.76 62.04,43.61 61.75,43.9 ; 59.24,42.02 U28.69 ; 60.4,89.41 57.47,89.41 57.18,89.11 57.18,84.16 57.43,83.91 61.3,83.91 C86.2 ; C107.2 62.44,54.73 U28.24 62.44,51.53 ; v1(63.14,44.92) 63.4,45.17 64.01,45.17 64.35,45.51 U28.5 ; C106.2 60.44,54.75 U28.29 60.44,52.04 61.54,50.94 62.25,50.94 v1(62.38,51.07)
  Top Layer w0.221: U28.5 67,45.51 C113.2 ; U28.76 62.04,41.23 C111.2
  Top Layer w0.254: v2(28.25,77.02) 27.91,77.36 26.8,77.36 ; 44.47,31.23 44.81,31.23 45.01,31.43 45.01,31.74 44.83,31.92 44.51,31.92 44.47,31.88 44.47,32.84 44.49,32.85
  Top Layer w0.305: 6.78,12.2 3.19,8.61 3.19,8.51 2.96,8.28 2.96,6.21 3.23,5.94 CN8.2 ; U27.20 61.59,87.46 62.73,86.32 62.73,85.34 C86.2 ; R53.2 37.98,58.89 R52.2 ; 25.44,68.48 25.48,68.44 25.48,67.93 25.39,67.84 U35.20
  Top Layer w0.355: U35.13 20.15,65.3 23.33,68.48 U35.21 25.44,68.48 27.57,70.61 C66.2 ; 38.67,62.43 38.64,62.43 37.84,63.24 37.84,64.17 37.85,64.17 37.85,64.97 ; 38.67,62.43 38.67,59.68 R52.2 ; 38.67,62.43 38.68,62.42 U19.2 ; 37.85,64.97 36.82,66 C34.1 ; 37.85,64.97 38.67,64.97 38.68,64.96 U19.4
  Top Layer w0.406: C66.2 29.2,70.83 v1(31.91,70.83)
  Top Layer w0.508: C26.2 57.88,67.65 ; C26.2 61.84,59.81 C22.2 ; C26.2 66.38,61.75 U21.4 67.49,60.85 67.51,60.87 67.51,63.1 ; 57.88,67.65 56.56,68.97 61.9,74.31 v1(66.75,74.31) ; 57.88,67.65 55.3,65.06 40.78,65.06 U19.4 ; U24.3 25.64,55.59 v3(24.41,55.59) ; 60.06,37.55 59.97,37.46 v1(59.97,32.21) 59.97,30.78 C105.2 59.87,30.5 59.87,25.49 ; U7.4 69.25,71.08 72.05,68.28 73.73,68.28 74.13,67.88 ; R98.2 67.41,30.72 v1(67.39,30.69) ; 59.87,25.49 59.87,24 R97.2 ; 59.87,25.49 57.91,25.49 ; U7.16 74.13,67.88 ; 74.13,67.88 74.97,68.71 C60.2 ; FB1.2 40.38,89.78 41.04,89.12 41.04,77.11 40.98,77.05 ; 67.38,60.54 65.46,60.54
  Top Layer w0.61: v1(56.41,51.4) 55.8,50.79 55.8,48.57 v1(56.03,48.34) ; 69.25,75.14 68.41,74.31 v1(66.75,74.31) ; 69.25,75.14 U7.4 ; 69.25,75.14 71.6,75.14 72.67,76.21 74.77,76.21 C89.2 75.23,78.65 C88.2 ; R88.1 49.43,39.49 49.43,31.71 ; 49.43,31.71 53.11,31.71 v1(54.13,30.69) 54.13,26.88 55.52,25.49 57.91,25.49 57.91,15.1 68.86,4.15 H4.4 ; 49.43,31.71 48.67,31.71 ; v1(21.27,29.52) 21.36,29.44 21.36,26.74 R29.2 ; 27.41,17.81 v1(24,21.22) ; 27.41,17.81 27.41,16.16 24.16,12.91 13.67,12.91 13.21,12.46 7.04,12.46 6.78,12.2 ; 27.41,17.81 42.06,17.81 48.67,24.42 48.67,31.71 ; 48.67,31.71 47.52,32.85 42.04,32.85 41.03,33.86 R79.2 ; 63.02,51.83 63.02,50.57 63.03,50.56 63.03,50.1 63.53,49.6 v1(63.66,49.6) ; 63.02,51.83 62.71,51.53 62.44,51.53 ; 63.02,51.83 63.95,51.83 64.28,52.16 65.35,52.16 67.36,54.17 67.36,60.52 ; U21.2 U21.4 ; v1(35.14,77.05) 48.46,77.05 56.54,68.97 ; v1(1.04,93.81) 1.04,94.8 ACTIVE.2 ; C86.2 v1(63.27,84.29) ; v1(58.85,43.9) 62.13,43.9 v1(63.14,44.92) ; U6.8 v1(57.07,30.69)
  Bottom Layer w0.508: v1(67.39,30.69) 65.87,32.21 v1(59.97,32.21) ; v2(28.25,77.02) 35.12,77.02 v1(35.14,77.05)
  Bottom Layer w0.61: H4.4 86.13,4.15 ; v1(56.41,51.4) 56.54,51.53 60.65,51.53 61.16,51.01 61.93,51.01 62.44,51.53 ; v1(63.66,49.6) 63.66,47.72 63.14,47.2 v1(63.14,44.92) ; v1(63.27,84.29) 63.27,79.55 66.45,76.37 66.45,74.61 v1(66.75,74.31) ; v1(1.04,93.81) 1.04,53.68 13.69,41.03 ; v1(24,21.22) 24,26.53 21.3,29.24 21.3,29.5 v1(21.27,29.52) 21.27,33.45 13.69,41.03 ; 13.69,41.03 13.9,41.03 24.41,51.55 v3(24.41,55.59) 26.87,58.05 26.87,65.78 v1(31.91,70.83) 35.14,74.05 v1(35.14,77.05) ; v1(57.07,30.69) v1(54.13,30.69) ; v1(56.03,48.34) v1(56.03,45.68)
VCCBAT: length 12.8
  Top Layer w0.508: C123.1 37.65,87.02 34.88,87.02 ; C124.2 33.4,81.85 32.9,82.35 32.9,83.94 32.88,83.96
  Top Layer w0.61: 34.88,87.02 33.19,87.02 32.88,86.71 32.88,83.96 ; C123.1 37.76,86.9 37.94,86.9 FB1.1
CAPP: length 5
  Top Layer w0.254: 70.89,87.65 70.85,87.61 67.81,87.61 67.65,87.77 67.65,87.78 67.32,88.11 66.14,88.11
CPAM: length 5
  Top Layer w0.305: 70.51,89.05 70.51,89.43 70.19,89.75 67.72,89.75 67.38,89.41 66.14,89.41
DM1: length 11.7
  Top Layer w0.305: 15.23,57.71 15.25,57.71 17.46,59.91 17.46,66.64 18.02,67.21 U35.10
DM2: length 15.1
  Top Layer w0.28: U35.8 16.77,68.48 13.59,65.3 13.59,62.32 13.87,62.04 13.87,58.85 12.73,57.71 12.63,57.71
DM3: length 12.8
  Top Layer w0.254: U35.6 17.87,69.75 17.17,70.45 17.17,75.78 16.28,76.67 16.28,78.9 USB3.2
DM4: length 17
  Top Layer w0.254: USB3.6 12.38,80.46 13.41,81.49 16.66,81.49 17.95,80.21 17.95,71.21 18.14,71.02 U35.4
DMU: length 21.9
  Top Layer w0.355: SW21.3 19.97,45.67 21.13,46.84 21.13,61.61 U35.15
DP1: length 12.9
  Top Layer w0.305: 15.23,55.71 17.92,58.41 17.92,66.27 18.23,66.57 U35.11
DP2: length 17.3
  Top Layer w0.305: v4(15.91,66.78) 16.98,67.84 U35.9
  Bottom Layer w0.28: 12.63,55.71 12.23,55.71 11.33,56.61 11.33,61.07 12.34,62.09 12.34,62.88 15.91,66.44 v4(15.91,66.78)
DP3: length 13.7
  Top Layer w0.254: U35.7 16.22,69.11 13.49,71.84 13.49,76.72 USB3.3
DP4: length 13
  Top Layer w0.254: U35.5 18,70.38 17.55,70.83 17.55,76.29 16.92,76.92
  Bottom Layer w0.28: v4(16.87,76.96) 13.63,76.96 USB3.7
DPU: length 23.5
  Top Layer w0.355: U35.16 25.01,65.3 25.34,64.98 25.34,64.35 22.2,61.22 22.2,47.03 23.23,45.99 23.23,44.66 23.37,44.52
GPIO0: length 49.8
  Top Layer w0.203: U28.77 62.44,41.94 63.02,41.36 63.33,41.36 73.94,30.76 73.94,15.2 82.17,6.97 82.17,6.11 82.85,5.42 84.16,5.42 85.42,6.69 86.13,6.69
GPIO1: length 45
  Top Layer w0.203: 83.59,6.69 83.3,6.69 74.45,15.55 74.45,30.91 63.61,41.74 63.32,41.74 62.84,42.22 U28.78
GPIO2: length 47.1
  Top Layer w0.203: U28.79 63.24,42.4 63.52,42.12 63.98,42.12 74.96,31.15 74.96,15.84 82.83,7.96 84.86,7.96 86.13,9.23
GPIO3: length 42.6
  Top Layer w0.203: 83.59,9.23 83.34,9.49 82.32,9.49 75.46,16.34 75.46,31.35 64.01,42.8 63.64,42.8
GPIO4: length 45
  Top Layer w0.203: U28.1 64.75,42.73 75.97,31.51 75.97,16.85 82.32,10.5 84.86,10.5 86.13,11.77
GPIO5: length 41.8
  Top Layer w0.203: U28.2 65.78,44.31 76.48,33.62 76.48,17.49 82.19,11.77 83.59,11.77
GPIO6: length 44.5
  Top Layer w0.203: 86.13,14.31 86.13,13.93 85.19,12.99 81.99,12.99 76.99,17.99 76.99,33.74 66.02,44.71 U28.3
GPIO7: length 40.5
  Top Layer w0.203: U28.4 66.25,45.11 77.5,33.87 77.5,18.63 81.81,14.31 83.59,14.31
GPIO8: length 39
  Top Layer w0.203: U28.6 v4(63.91,45.91)
  Top Layer w0.305: v4(70.52,74.38) U7.3
  Bottom Layer w0.203: v4(63.91,45.91) 64.36,45.91 64.64,45.63 66.04,45.63 66.83,46.41 66.83,64.98 72.54,70.7 72.54,74.55 72.07,75.02 71.16,75.02 v4(70.52,74.38)
GPIO9: length 33.7
  Top Layer w0.203: U28.7 65.68,46.31 65.68,46.19
  Top Layer w0.305: U7.2 71.79,74.25 v4(71.92,74.38)
  Bottom Layer w0.203: v4(65.81,46.19) 66.01,46.39 66.04,46.39 66.37,46.72 66.37,65.21 71.92,70.76 v4(71.92,74.38)
GPIO10: length 51.8
  Top Layer w0.203: v4(63.91,46.7) 64.73,46.7 U28.8 ; U27.13 58.85,92.01 v4(58.83,92.04)
  Bottom Layer w0.203: v4(58.83,92.04) 58.5,91.7 58.5,91.17 58.06,90.74 58.06,82 65.43,74.64 65.43,48.22 v4(63.91,46.7)
GPIO11: length 49.6
  Top Layer w0.203: U28.9 65.65,47.11 65.68,47.08
  Top Layer w0.305: v2(59,90.71) 60.4,90.71
  Bottom Layer w0.203: v4(65.81,46.95) 65.81,75.27 58.42,82.66 58.42,90.41 58.72,90.71 v2(59,90.71)
GPIO12: length 10.1
  Top Layer w0.203: R68.1 70.23,47.8 66.16,47.8 66.05,47.91 U28.11
GPIO13: length 9.6
  Top Layer w0.203: U28.12 66.08,48.31 66.29,48.1 71.45,48.1 R67.1
GPIO14: length 9.1
  Top Layer w0.203: U28.13 66.11,48.71 66.42,48.41 72.67,48.41 R66.1
GPIO15: length 9.1
  Top Layer w0.203: U28.14 66.17,49.11 66.4,48.89 66.4,48.86 66.54,48.71 73,48.71 R65.1
GPIO16: length 9
  Top Layer w0.203: R64.1 67.51,50.68 66.74,49.91 U28.16
GPIO17: length 9.2
  Top Layer w0.203: 73.18,52.28 68.35,52.28 66.38,50.31 U28.17
GPIO18: length 9.9
  Top Layer w0.203: U28.18 65.85,50.71 68.87,53.73 R62.1
GPIO19: length 10.4
  Top Layer w0.203: R61.1 69.63,55.25 65.49,51.11 U28.19
GPIO20: length 241.8
  Top Layer w0.203: U28.20 64.35,51.51 63.91,51.07 v4(63.91,50.89) ; v2(27.2,49.11) 27.2,49.92 30.28,53 33.91,53 34.72,53.81 v4(35.53,53.81) 35.53,55 33.68,56.86 33.68,61.66 34.4,62.37 35.09,62.37 U19.7 ; H4.28 82.14,33.3 82.14,31.45 82.77,30.82 86.75,30.82 87.87,29.69 87.87,5.57 87.75,5.44 85.45,5.44 84.81,4.81 84.81,3.57 84.13,2.89 10.76,2.89 v2(6.63,7.02) 4.6,7.02 CN8.3
  Top Layer w0.305: U19.7 36.45,62.42 36.91,61.97 v4(36.91,61.58) 36.91,61.07 35.93,60.1 R52.1
  Bottom Layer w0.203: v4(63.91,50.89) 63.91,50.96 62.71,52.16 62.71,55.76 61.95,56.53 60.15,56.53 59.64,56.02 44.17,56.02 40.09,60.1 39.11,60.1 37.6,61.6 36.93,61.6 v4(36.91,61.58) ; v2(6.63,7.02) 20.52,7.02 24.99,11.49 24.99,46.9 v2(27.2,49.11)
GPIO21: length 211.6
  Top Layer w0.203: v2(88.64,13.12) 88.64,31.33 86.6,33.37 85.2,33.37 84.81,33.75 84.81,35.82 H4.30 ; v2(62.41,56.96) 64.85,54.52 64.85,52.97 64.76,52.88 64.28,52.88 64.02,52.62 63.64,52.62 ; v2(44.96,56.68) 41.57,56.68 39.95,55.05 36.75,55.05 ; v2(5.67,7.91) 5.65,7.94 CN8.4 ; 36.75,55.05 35.98,55.82 R53.1 35.43,56.68 34.94,57.18 34.94,60.95 U19.8 ; 36.75,55.05 36.75,53.5 35.41,52.16 30.35,52.16 27.94,49.75 v2(27.94,49.13)
  Bottom Layer w0.203: v2(44.96,56.68) 45.18,56.45 59.6,56.45 59.98,56.83 62.28,56.83 v2(62.41,56.96) ; v2(27.94,49.13) 27.94,48.85 25.71,46.61 25.71,42.63 25.53,42.45 25.53,21.72 ; 25.53,21.72 31.34,15.9 81.12,15.9 82.21,14.8 82.21,13.09 88.64,13.09 ; 25.53,21.72 25.53,11.01 21.16,6.64 7.37,6.64 6.68,5.95 5.82,5.95 5.67,6.1 v2(5.67,7.91)
GPIO22: length 45.5
  Top Layer w0.203: v4(64.29,53.44) 64.05,53.21 63.43,53.21 63.24,53.02 U28.22
  Top Layer w0.305: U27.14 57.98,91.36 v4(57.94,91.4)
  Bottom Layer w0.203: v4(57.94,91.4) 57.94,91.35 57.68,91.1 57.68,81.7 65.05,74.33 65.05,54.2 v4(64.29,53.44)
GPIO23: length 56.5
  Top Layer w0.203: v4(63.27,54.57) 63.27,54.25 62.84,53.82 U28.23 ; 29.85,84.22 29.8,84.17 29.8,82.71 30.76,81.75 31.35,81.75 31.35,83.96 ; v4(44.73,73.82) 36.5,73.82 34.21,76.11 34.21,78.04 31.39,80.86 31.39,81.56
  Bottom Layer w0.203: v4(44.73,73.82) 44.73,69.15 55.12,58.76 59.69,58.76 59.69,58.76 61.38,58.76 63.27,56.87 v4(63.27,54.57)
GPIO24: length 86.3
  Top Layer w0.203: 23.92,80.41 22.59,80.41 19.41,83.6 19.41,87.94 19.92,88.45 21.8,88.45 21.87,88.52 ; 23.92,80.41 23.92,81.05 ; 23.92,80.41 28.49,80.41 ; U28.25 62.04,54.1 61.86,54.29 61.86,54.85 v4(61.37,55.34) ; 28.49,80.41 29.75,80.41 v4(30.04,80.7) ; 28.49,80.41 28.47,80.44 R96.1
  Bottom Layer w0.203: v4(61.37,55.34) 61.33,55.31 60.38,55.31 59.77,54.7 56.55,54.7 56.53,54.68 42.78,54.68 40.44,52.34 36.04,52.34 34.29,54.09 34.29,69.89 37.24,72.83 37.24,78.14 34.78,80.6 30.14,80.6 v4(30.04,80.7)
GPIO25: length 98.4
  Top Layer w0.203: 61.64,52.62 61.64,54.07 61.44,54.27 61.44,54.43 v4(61.3,54.57) ; v4(25.3,85.94) 25.35,85.89 25.35,84.22
  Bottom Layer w0.203: H5.1 8.92,96.66 9.17,96.4 14.63,96.4 25.09,85.94 v4(25.3,85.94) 25.3,80.85 26.1,80.06 34.76,80.06 36.91,77.91 36.91,72.93 33.99,70.01 33.99,53.91 35.97,51.93 40.61,51.93 43.04,54.35 60.29,54.35 60.72,54.79 61.24,54.79 61.36,54.66 61.36,54.63 v4(61.3,54.57)
GPIO26: length 120.6
  Top Layer w0.203: v4(61.08,53.81) 61.24,53.65 U28.27
  Bottom Layer w0.203: H4.14 83.26,17.05 32.31,17.05 25.88,23.48 25.88,42.38 28.83,45.32 38.43,45.32 47.12,54.01 60.88,54.01 v4(61.08,53.81)
GPIO27: length 36
  Top Layer w0.203: v4(61.54,51.78) 61.29,52.03 61.03,52.03 60.84,52.22 U28.28 ; U19.1 40.68,58.69 v4(40.69,58.69) 45.11,58.69 R95.1
  Bottom Layer w0.203: v4(40.69,58.69) 40.72,58.69 43.84,55.56 59.69,55.56 60.3,56.17 60.38,56.17 60.43,56.22 61.82,56.22 62.26,55.79 62.26,55.77 62.33,55.69 62.33,52.56 v4(61.54,51.78)
GPIO28: length 57.4
  Top Layer w0.203: v2(29.26,41.31) 28.07,40.12 28.07,39.53 17.02,28.48 17.02,27.16 15.37,25.52 CARD2.7 ; 57.64,52.62 57.64,53.24 56.49,54.39 42.15,54.39 31.56,43.8 v2(31.14,43.8)
  Bottom Layer w0.203: v2(29.26,41.31) 29.26,41.92 v2(31.14,43.8)
GPIO29: length 110.7
  Top Layer w0.203: 22.1,91.52 20.83,91.52 18.64,89.33 18.64,85.53 16.87,83.76 v4(13.72,83.76) ; U28.37 57.24,53.21 56.47,53.99 42.42,53.99 31.52,43.09 19.04,43.09 12.42,49.7 12.42,51.04 5.99,57.47 v4(5.99,57.49)
  Bottom Layer w0.203: v4(5.99,57.49) 5.74,57.49 4.75,58.48 4.75,77.6 8.58,81.43 13.25,81.43 13.72,81.89 v4(13.72,83.76)
GPIO30: length 57.3
  Top Layer w0.203: CARD2.5 15.69,23.32 17.81,25.44 17.81,28.74 42.65,53.58 56.39,53.58 56.84,53.13 U28.38
GPIO31: length 59.8
  Top Layer w0.203: v4(22.82,25.8) 22.82,33.07 42.96,53.21 56.33,53.21 56.44,53.09 U28.39 ; CARD2.3 v4(16.54,21.12)
  Bottom Layer w0.203: v4(22.82,25.8) 21.22,25.8 v4(16.54,21.12)
GPIO32: length 58.6
  Top Layer w0.203: R94.1 49.62,58.63 49.62,62.44 48.36,63.69 U19.3 40.68,63.69 v2(39.04,63.69) ; v2(55.07,52.18) 55.61,52.18 U28.40
  Bottom Layer w0.203: v2(55.07,52.18) 55.98,52.18 56.13,52.33 61.52,52.33 61.95,52.77 61.95,55.66 61.9,55.66 61.65,55.92 60.55,55.92 59.79,55.15 43.26,55.15 37.39,61.02 36.67,61.02 36.35,61.34 36.35,61.81 37.26,62.72 38.07,62.72 v2(39.04,63.69)
GPIO33: length 59.5
  Top Layer w0.203: U28.42 41.53,51.11 23.42,33.01 23.42,22.08 22.12,20.79 20.35,20.79 19.57,20.02 CARD2.2
GPIO34: length 109
  Top Layer w0.203: U28.43 41.89,50.71 28.98,37.81 v4(28.98,19.27)
  Bottom Layer w0.203: 86.13,16.85 85.24,16.85 84,15.61 82.9,15.61 81.99,16.51 31.74,16.51 v4(28.98,19.27)
GPIO35: length 101.7
  Top Layer w0.203: v4(32.79,18.76) 29.87,21.68 29.87,38.06 42.12,50.31 U28.44
  Bottom Layer w0.203: 83.59,19.39 82.96,18.76 v4(32.79,18.76)
GPIO36: length 103
  Top Layer w0.203: v4(32.79,19.77) 30.63,21.93 30.63,38.19 42.36,49.91 U28.45
  Bottom Layer w0.203: 86.13,19.39 85.5,19.39 84.23,20.66 82.93,20.66 81.66,19.39 33.17,19.39 v4(32.79,19.77)
GPIO37: length 98.6
  Top Layer w0.203: v4(32.81,20.55) 31.39,21.96 31.39,38.31 42.59,49.51 U28.46
  Bottom Layer w0.203: 83.59,21.93 83.3,21.93 81.12,19.75 33.89,19.75 33.09,20.55 v4(32.81,20.55)
GPIO38: length 96.9
  Top Layer w0.203: v4(33.05,23.33) 32.06,24.32 32.06,38.34 42.83,49.11 U28.47
  Bottom Layer w0.203: v4(33.05,23.33) 33.05,23.18 33.66,22.57 79.91,22.57 80.39,23.05 84.86,23.05 85.98,21.93 86.13,21.93
GPIO39: length 92.7
  Top Layer w0.203: U28.48 43.06,48.71 32.66,38.31 32.66,24.6 v4(33.17,24.09)
  Bottom Layer w0.203: v4(33.17,24.09) 33.17,23.99 33.6,23.56 33.6,23.53 34.16,22.97 76.25,22.97 77.59,24.32 83.56,24.32 83.59,24.34 83.59,24.47
GPIO40: length 93.9
  Top Layer w0.203: U28.49 43.3,48.31 33.4,38.42 v4(33.4,25.67)
  Bottom Layer w0.203: 86.13,24.47 86,24.6 84.76,24.6 84.67,24.69 84.67,25.29 84.27,25.69 77.47,25.69 75.16,23.38 36.45,23.38 34.16,25.67 v4(33.4,25.67)
GPIO41: length 88
  Top Layer w0.203: v4(34.06,27.21) 33.93,27.34 33.93,38.19 42.86,47.11 U28.52
  Bottom Layer w0.203: v4(34.06,27.21) 37.49,23.79 74.4,23.79 77.62,27.01 83.59,27.01
GPIO42: length 89.1
  Top Layer w0.203: U28.53 43.09,46.71 34.57,38.19 v4(34.57,28.66)
  Bottom Layer w0.203: 86.13,27.01 84.86,28.28 78.13,28.28 74.02,24.17 39.07,24.17 v4(34.57,28.66)
GPIO43: length 83.9
  Top Layer w0.203: U28.54 43.33,46.31 35.13,38.11 35.13,30.34 35.66,29.81 v4(35.71,29.81)
  Bottom Layer w0.203: v4(35.71,29.81) 40.94,24.57 73.15,24.57 77.88,29.3 83.34,29.3 83.59,29.55
GPIO44: length 85.6
  Top Layer w0.203: U28.55 43.56,45.91 35.69,38.03 v4(35.69,30.69)
  Bottom Layer w0.203: 86.13,29.55 84.86,30.82 78.13,30.82 72.26,24.95 41.43,24.95 v4(35.69,30.69)
GPIO45: length 80.7
  Top Layer w0.203: v4(36.27,31.96) 36.27,37.98 43.8,45.51 U28.56
  Bottom Layer w0.203: v4(36.27,31.96) 42.9,25.34 71.75,25.34 78.26,31.84 83.34,31.84 83.59,32.09
GPIO46: length 82
  Top Layer w0.203: U28.57 44.03,45.11 36.86,37.93 v4(36.86,33.36)
  Bottom Layer w0.203: v4(36.86,33.36) 43.64,26.58 43.64,26.27 44.14,25.77 44.45,25.77 44.5,25.72 70.1,25.72 77.88,33.49 84.73,33.49 86.13,32.09
HEARTBEAT: length 77.4
  Top Layer w0.355: H5.2 11.46,96.86 4.23,89.64 2.72,89.64 2.18,89.1 2.18,46.58 2.19,46.57 0.48,44.86 0.48,35.58 1.3,34.76 6.82,34.76 R3.1
LDOO: length 4.6
  Top Layer w0.305: U27.18 58.58,88.76 C97.1 C98.1
LED1: length 24.6
  Top Layer w0.406: 8.93,69.89 8.75,69.71 PORT3.1 3.36,69.75 PORT4.2
LED2: length 23.7
  Top Layer w0.406: 8.94,67.41 7.42,65.89 PORT2.2 3.37,48.35
LED4: length 92.4
  Top Layer w0.28: v4(8.29,94.83) R59.1
  Top Layer w0.305: U35.22 25.31,69.11 27.56,71.36 28.86,71.36 29.35,71.84 v4(29.42,71.84)
  Top Layer w0.406: R59.1 6.63,94.51 1.27,89.15 PORT2.1 1.27,48.35
  Bottom Layer w0.254: 29.4,72.09 29.4,71.87 v4(29.42,71.84)
  Bottom Layer w0.28: v4(8.29,94.83) 8.29,94.22 9.15,93.36 15.75,93.36 21.17,87.93 21.17,83.39 21.1,83.32 21.1,80.39 29.4,72.09
MDM: length 15.1
  Top Layer w0.355: USB5.2 17.98,40.36 18.82,39.52 SW21.1
MDP: length 19.3
  Top Layer w0.355: USB5.3 16.1,39.71 17.53,38.29 22.13,38.29 23.37,39.52
OUTL: length 6.5
  Top Layer w0.305: R70.2 69.63,93.06 67.28,90.71 66.14,90.71
OUTR: length 8.8
  Top Layer w0.305: 66.14,91.36 67.17,91.36 68.86,93.05 68.86,95.59 69.37,96.1 70.13,96.1 70.9,96.87 R69.2
OVCUR: length 11.6
  Top Layer w0.254: U35.26 25.13,71.65 25.55,72.07 25.55,74.12 26.8,75.36 ; R102.1 27.8,75.19 29.18,76.57 31.39,76.57 31.71,76.88 U39.4
PSRAM_SS: length 27.4
  Top Layer w0.203: v4(53.62,44.54) 53.79,44.71 U28.58 ; U33.1 62.73,25.49 v4(61.77,26.45) 61.12,25.8 61.12,24
  Bottom Layer w0.203: v4(61.77,26.45) 61.77,28.25 55.88,34.14 55.88,37.99 53.62,40.26 v4(53.62,44.54)
PWREN: length 10.8
  Top Layer w0.254: U39.3 31.71,75.74 31.45,76.01 29.61,76.01 25.93,72.33 25.93,71.77 25.18,71.02 U35.25
QSPI_SCLK: length 23.6
  Top Layer w0.203: U28.71 60.04,39.53 59.75,39.24 58.45,39.24 55.63,36.43 55.63,35.54 56.41,34.76 U6.6 57.94,34.76 58.7,34 58.7,32.98 58.56,32.84 56.08,32.84 55.7,32.45 55.7,29.38 57.05,28.03 57.83,28.03
QSPI_SD0: length 17.7
  Top Layer w0.203: U28.72 60.44,39.4 59.91,38.86 58.5,38.86 57.12,37.48 57.12,36.07 U6.5 58.19,36.03 59.08,35.14 59.08,30.55 57.83,29.3
QSPI_SD1: length 22.5
  Top Layer w0.203: 63.38,26.76 64.16,26.76 64.65,27.25 64.65,29.95 62.64,31.96 62.64,32.85 63.27,33.49 U6.2 64.67,33.49 65.51,34.33 65.51,36.45 63.02,38.95 61.62,38.95 61.24,39.33 U28.74
QSPI_SD2: length 19
  Top Layer w0.203: U28.73 60.84,39.23 60.6,38.99 60.6,36.03 61.87,34.76 ; 61.87,34.76 61.87,28.28 62.13,28.03 63.38,28.03 ; 61.87,34.76 U6.3
QSPI_SD3: length 22
  Top Layer w0.203: 55.27,33.49 U6.7 ; 55.27,33.49 55.27,28.28 56.79,26.76 57.83,26.76 ; 55.27,33.49 55.27,36.66 58.15,39.55 59.34,39.55 59.64,39.85 59.64,42.8
QSPI_SS: length 19.7
  Top Layer w0.203: 61.64,42.8 61.64,41.68 61.6,41.65 61.6,39.56 61.91,39.25 63.29,39.25 65.95,36.6 65.95,34.28 ; 65.95,34.28 65.95,32.22 ; 65.95,34.28 R98.1 ; 65.95,32.22 U6.1 ; 65.95,32.22 65.95,29.16 R4.1
RESET: length 173.1
  Top Layer w0.203: 26.48,45.9 26.46,45.87 26.46,45.85 24.12,43.51 19.45,43.51 18.85,44.11 18.85,61.53 23.2,65.89 24.08,65.89 24.13,65.94 U35.17 ; 26.48,45.9 26.5,45.88 32.89,45.88 41.81,54.8 56.62,54.8 58.04,53.37 U28.35 ; 26.48,45.9 26.48,51.73 R60.1
  Top Layer w0.28: v4(34.95,54.62) 29.54,54.62 26.7,51.78 R60.1
  Bottom Layer w0.254: 41.3,68.52 34.95,62.17 v4(34.95,54.62)
  Bottom Layer w0.28: 87.65,79.85 87.37,80.13 87.35,80.13 87.25,80.04 86.89,80.04 80.68,86.25 74.97,86.25 67.56,93.66 52.27,93.66 41.28,82.66 41.28,70.8 41.3,70.78 41.3,68.52
SWCLK: length 33.2
  Top Layer w0.203: U28.33 58.84,53.62 56.85,55.61 41.28,55.61 37.52,51.85 31.08,51.85 30.54,51.32 30.54,51.03 30.8,50.77 30.8,50.7 30.53,50.43 30.53,50.28 H2.1
SWDATA: length 29
  Top Layer w0.203: U28.34 58.44,53.43 56.67,55.21 41.55,55.21 37.69,51.34 36.06,51.34 36.04,51.36 35.13,51.36 35.11,51.34 34.69,51.34 33.6,50.25 H2.2
USB-DM: length 25
  Top Layer w0.254: 81.32,70.19 80.05,70.19 74.84,64.98 70.65,64.98 69.89,65.74 69.89,68.03 66.71,71.21 U7.6 ; 81.32,70.19 81.32,70.7 81.57,70.95 USB2.A7 ; 81.32,70.19 81.56,69.95 USB2.B7
USB-DP: length 25.1
  Top Layer w0.254: U7.5 67.98,71.21 71.1,68.08 71.1,65.67 71.28,65.49 74.59,65.49 80.54,71.45 USB2.B6 83.37,71.45 83.61,71.21 83.61,70.7 83.36,70.45 USB2.A6
USB_HOST_DM: length 42.4
  Top Layer w0.203: U28.66 58.04,42.4 53.19,37.55 v4(52.6,37.55)
  Top Layer w0.254: SW21.2 21.17,40.81 v4(26.47,40.81)
  Bottom Layer w0.203: v4(26.47,40.81) 26.56,40.81 27.71,39.66 27.71,39.57 29.73,37.55 v4(52.6,37.55)
USB_HOST_DP: length 40.8
  Top Layer w0.203: v4(53.24,36.99) 58.44,42.2 U28.67
  Top Layer w0.254: 23.37,42.02 23.44,41.95 26.21,41.95 27.15,41.01 v4(27.15,39.43)
  Bottom Layer w0.203: v4(53.24,36.99) 29.59,36.99 v4(27.15,39.43)
VNEG: length 3.6
  Top Layer w0.305: 66.14,90.06 67.26,90.06 67.97,90.77 69.05,90.77 69.3,91.02
VREG_AVDD: length 14.6
  Top Layer w0.203: U28.61 54.47,41.24 48.67,41.24 C35.2 47.53,39.83 L29.1 47.53,35.35 C103.2
VREG_VIN: length 8.7
  Top Layer w0.221: U28.64 57.24,42.22 55.12,40.09 51.96,40.09 R88.2
  Top Layer w0.305: R88.2 51.87,38.68 51.5,38.31
VUSBOUT: length 58.2
  Top Layer w0.508: 9.6,92.07 9.6,91.46 12.34,88.72 12.34,82.74 USB3.5 ; U39.6 29.79,77.68 29.79,78.85 28.69,79.96 22.4,79.96 22.35,80 22.11,80 19.17,82.94 15.08,82.94 14.98,82.84 USB3.1
  Top Layer w0.61: 12.63,60.21 12.47,60.36 12.47,72.8 10.57,74.7 10.57,81.75 11.53,82.71 USB3.5 USB3.1
  Bottom Layer w0.61: 12.63,60.21 15.23,60.21
XI: length 7.6
  Top Layer w0.305: X1.3 20.75,76.16 20.75,72.03 20.78,72 20.43,71.65 U35.3
XO: length 4.9
  Top Layer w0.305: U35.2 19.87,72.29 20.17,72.59 20.17,75.28 19.91,75.54 19.32,75.54
$1N1726: length 9.2
  Top Layer w0.508: 21.37,24.36 21.25,24.23 21.25,21.97 21.02,21.74 C27.2
  Top Layer w0.61: C27.2 18.36,22.22 CARD2.4
$1N2125: length 3.4
  Top Layer w0.305: USB2.B5 79.08,72.45 R31.2
$1N2134: length 3
  Top Layer w0.254: 80.05,68.51 80.05,68.87 80.63,69.45 USB2.A5
$1N2136: length 20.7
  Top Layer w0.254: USB2.1 81.71,64.98 80.47,64.98 ; USB2.4 USB2.3
  Bottom Layer w0.254: USB2.2 83.72,74.4 86.67,74.4 USB2.4
  Bottom Layer w0.305: USB2.1 USB2.3
$1N6229: length 23.6
  Top Layer w0.28: v4(10.35,67.43) 10.92,67.43 10.94,67.41
  Top Layer w0.305: v4(26.54,71.94) 26.54,71.69 25.23,70.38 U35.24
  Bottom Layer w0.28: v4(10.35,67.43) 15.73,67.43 22.43,74.13 24.36,74.13 v4(26.54,71.94)
$1N6268: length 27.5
  Top Layer w0.28: v4(10.34,69.7) 10.74,69.7 10.93,69.89
  Top Layer w0.305: v4(28.61,71.97) 27.51,71.97 25.29,69.75 U35.23
  Bottom Layer w0.28: v4(28.61,71.97) 25.94,74.64 22.22,74.64 17.29,69.7 v4(10.34,69.7)
$1N6846: length 2.5
  Top Layer w0.61: ACTIVE.1 R59.2
$1N9100: length 2.5
  Top Layer w0.254: U24.2 24.93,51.78 R60.2
$1N12629: length 17.5
  Top Layer w0.254: D1.1 81.33,59.14 81.56,58.91 81.56,45.81 80.92,45.17 80.29,45.17 80.05,45.41 HDMI1.18
$1N19302: length 4.9
  Top Layer w0.406: USB5.1 6.55,41.01 7.59,42.05 D2.2
$1N22005: length 4.2
  Top Layer w0.254: HDMI1.1 76.29,53.91 R61.2
$1N22047: length 4
  Top Layer w0.254: HDMI1.3 75.77,52.91 R62.2
$1N22089: length 3.7
  Top Layer w0.254: R63.2 75.15,52.41 HDMI1.4
$1N22131: length 3.9
  Top Layer w0.254: HDMI1.6 76.2,51.41 75.47,50.68 R64.2
$1N22173: length 4.4
  Top Layer w0.254: HDMI1.7 76.7,50.91 R65.2
$1N22252: length 5.5
  Top Layer w0.254: HDMI1.10 77.5,49.41 76.23,48.14 76.23,47.39 R67.2
$1N22294: length 6
  Top Layer w0.254: HDMI1.12 77.51,48.41 76.73,47.63 76.73,46.37 R68.2
$1N22336: length 4.6
  Top Layer w0.254: R66.2 77.23,49.91 HDMI1.9
$1N62204: length 18.1
  Top Layer w0.254: CN5.2 80.91,95.08 77.26,95.08 77.24,95.1 77.24,95.73 76.86,96.12 73.41,96.12 R69.1
  Bottom Layer w0.254: CN5.2 82.96,94.26 82.96,90.83 CN5.2
$1N62212: length 19.6
  Top Layer w0.254: R70.1 74.69,95.08 74.7,95.1 74.7,93.94 74.96,93.69 77.11,93.69 79.45,91.35 79.45,89.23 79.43,89.21 80.92,87.72 83.35,87.72 CN5.3
$1N70083: length 7
  Top Layer w0.203: U28.30 60.04,53.99 59.73,54.3 59.73,55.88 57.72,57.89 X4.3
$1N70156: length 3.1
  Top Layer w0.508: R3.2 7.5,32.57 LED1.2
$1N70158: length 5.7
  Top Layer w0.203: L29.2 R79.1 42.96,34.39 C118.2
$1N104865: length 2.9
  Top Layer w0.203: 26.88,81.05 26.85,81.08 26.85,83.96
$1N104968: length 9.2
  Top Layer w0.203: R90.2 19.92,84.19 19.92,86.53 20.4,87.02 22.1,87.02
$1N117781: length 19.1
  Top Layer w0.254: 23.85,84.22 v4(22.26,84.22) ; H5.3 14.1,97.65 v2(14.1,95.03)
  Bottom Layer w0.254: v4(22.26,84.22) 21.56,84.91 21.56,88.52 15.05,95.03 v2(14.1,95.03)
$1N125756: length 4.8
  Top Layer w0.254: R103.2 33.35,77.96 32.61,78.7 31.04,78.7 30.76,78.42 U39.5
$1N130181: length 8.6
  Top Layer w0.254: R4.2 66.07,26.2 61.85,21.98 60.73,21.98 SW22.1

## Copper pours and planes (outline as drawn; the poured copper is in the pictures)
AGND on Top Layer: 46.95,100.23 90,100.23 90,77.41 46.95,77.41
GND on Top Layer: 41.17,33.11 48.63,33.11 48.63,29.4 41.17,29.4
GND on Bottom Layer: -0.04,0.03 89.96,0.03 89.96,100.03 35.74,100.03 35.74,93.77 21.05,93.77 21.05,99.92 -0.04,100.03
GND on Bottom Layer: 0,100 90,100 90,0 0,0
VCC on Top Layer: 46.96,77.34 89.83,77.34 89.83,57.13 46.96,57.13

## Text on the board
Bottom Silkscreen Layer: PICO COMPUTER 3 / FIRMWARE: Any RP2350 / OPTION RESET PICO COMPUTER 3 | I2S: GP10,GP11,GP22 / SDCard: GP33,GP30,GP31,GP28 / CYW43: GP23,GP24,GP25,GP29 / I2C: GP20,GP21 / UART GP8,GP9 / HDMI: GP12-GP19 / PSRAM: GP47 / RTC ALARM: GP32 / RTC 32KHz: GP27 / For VGA an external / resistor network is needed / H/VSYNC GP0,GP1 / B/G0/G1/R GP2,GP3,GP4,GP5 | VCC VCC | GND GND | GP04 GP05 | GP36 GP35 | GP34 GP26 | GP06 GP07 | GP00 GP01 | GP38 GP37 | GP40 GP39 | GP46 GP45 | GP44 GP43 | GP42 GP41 | GND  GP21 | +5V  GP20 | GP02  GP03
Top Silkscreen Layer: GPIO25 | HEARTBEAT | CYW | 43 | PROG | ON/OFF | RESET | RMC2 | CR2032 | AUDIO | PICO COMPUTER 3 V1.3 / PCB DESIGN: PETER MATHER / MMBASIC: GEOFF GRAHAM, PETER MATHER | SYSTEM I2C | SCK | SDA | VCC | GND | Switch to disable for / uploading new firmware | DEBUG | BOOT | GP03  GP02 | GP39 GP40 | GP35 GP36 | GP26 GP34 | GP07 GP06 | GP05 GP04 | GP21 GND | GP20 +5V | GP45 GP46 | GP43 GP44 | GP41 GP42 | GP37 GP38 | GP01 GP00 | VCC  VCC | GND  GND | CLK | DAT | USB | HUB | DISABLE | ENABLE
